# EAGLE schematic Schematic (EAGLE 9.6.2)
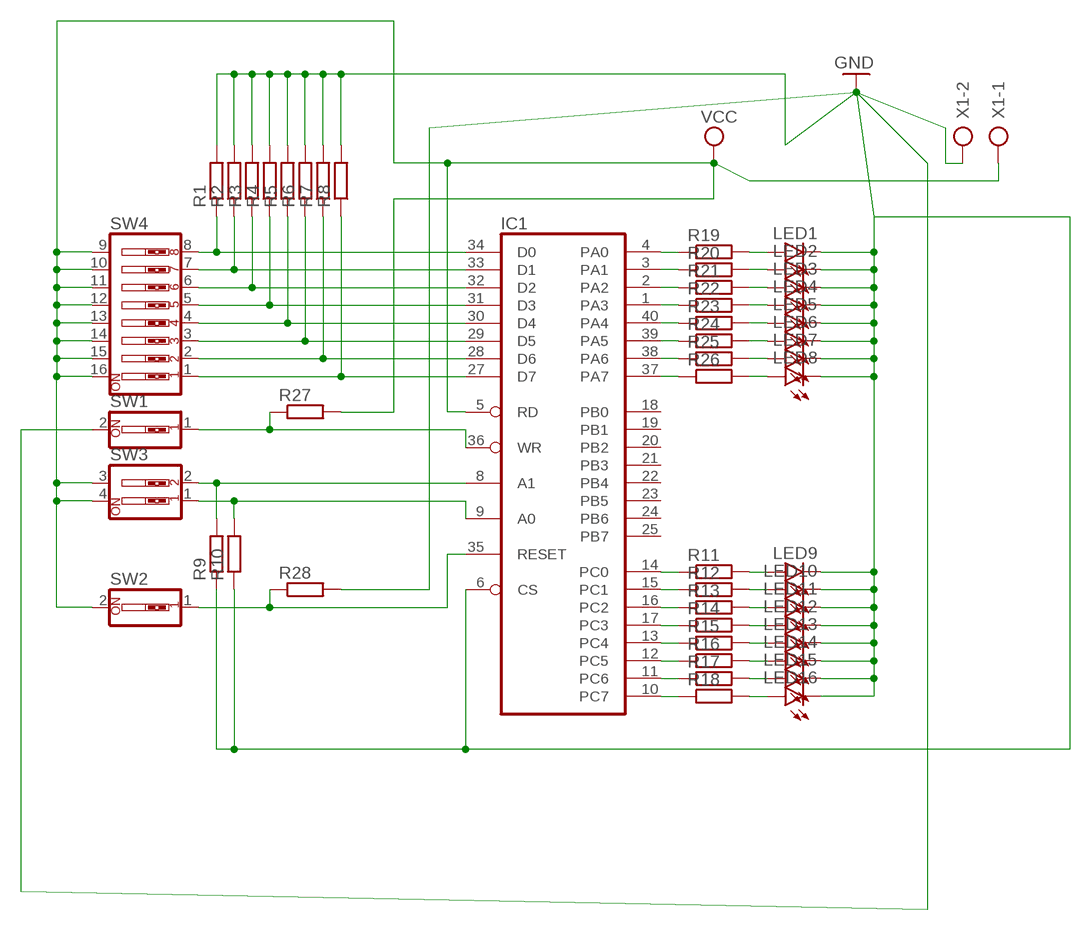
[diagram p0: schematic, sheet 1]

## Parts
IC1  8255A  [DIL40]
LED1  LED5MM  [LED5MM]
LED2  LED5MM  [LED5MM]
LED3  LED5MM  [LED5MM]
LED4  LED5MM  [LED5MM]
LED5  LED5MM  [LED5MM]
LED6  LED5MM  [LED5MM]
LED7  LED5MM  [LED5MM]
LED8  LED5MM  [LED5MM]
LED9  LED5MM  [LED5MM]
LED10  LED5MM  [LED5MM]
LED11  LED5MM  [LED5MM]
LED12  LED5MM  [LED5MM]
LED13  LED5MM  [LED5MM]
LED14  LED5MM  [LED5MM]
LED15  LED5MM  [LED5MM]
LED16  LED5MM  [LED5MM]
R1  R-EU_0207/10  [0207/10]
R2  R-EU_0207/10  [0207/10]
R3  R-EU_0207/10  [0207/10]
R4  R-EU_0207/10  [0207/10]
R5  R-EU_0207/10  [0207/10]
R6  R-EU_0207/10  [0207/10]
R7  R-EU_0207/10  [0207/10]
R8  R-EU_0207/10  [0207/10]
R9  R-EU_0207/10  [0207/10]
R10  R-EU_0207/10  [0207/10]
R11  R-EU_0207/10  [0207/10]
R12  R-EU_0207/10  [0207/10]
R13  R-EU_0207/10  [0207/10]
R14  R-EU_0207/10  [0207/10]
R15  R-EU_0207/10  [0207/10]
R16  R-EU_0207/10  [0207/10]
R17  R-EU_0207/10  [0207/10]
R18  R-EU_0207/10  [0207/10]
R19  R-EU_0207/10  [0207/10]
R20  R-EU_0207/10  [0207/10]
R21  R-EU_0207/10  [0207/10]
R22  R-EU_0207/10  [0207/10]
R23  R-EU_0207/10  [0207/10]
R24  R-EU_0207/10  [0207/10]
R25  R-EU_0207/10  [0207/10]
R26  R-EU_0207/10  [0207/10]
R27  R-EU_0207/10  [0207/10]
R28  R-EU_0207/10  [0207/10]
SW1  SW_DIP-1  [EDG-01]
SW2  SW_DIP-1  [EDG-01]
SW3  SW_DIP-2  [EDG-02]
SW4  SW_DIP-8  [EDG-08]
X1  AK500/2  [AK500/2]

## Nets
GND: IC1.6(CS) LED1.K(C) LED2.K(C) LED3.K(C) LED4.K(C) LED5.K(C) LED6.K(C) LED7.K(C) LED8.K(C) LED9.K(C) LED10.K(C) LED11.K(C) LED12.K(C) LED13.K(C) LED14.K(C) LED15.K(C) LED16.K(C) R1.2 R2.2 R3.2 R4.2 R5.2 R6.2 R7.2 R8.2 R9.1 R10.1 R28.2 SW1.2 X1.2
N$1: IC1.34(D0) R1.1 SW4.8
N$2: IC1.33(D1) R2.1 SW4.7
N$3: IC1.32(D2) R3.1 SW4.6
N$4: IC1.31(D3) R4.1 SW4.5
N$5: IC1.30(D4) R5.1 SW4.4
N$6: IC1.29(D5) R6.1 SW4.3
N$7: IC1.28(D6) R7.1 SW4.2
N$8: IC1.27(D7) R8.1 SW4.1
N$9: IC1.8(A1) R9.2 SW3.2
N$10: IC1.9(A0) R10.2 SW3.1
N$11: IC1.4(PA0) R19.1
N$12: LED1.A R19.2
N$13: LED2.A R20.2
N$14: LED3.A R21.2
N$15: LED4.A R22.2
N$16: LED5.A R23.2
N$17: LED6.A R24.2
N$18: LED7.A R25.2
N$19: LED8.A R26.2
N$20: IC1.37(PA7) R26.1
N$21: IC1.38(PA6) R25.1
N$22: IC1.39(PA5) R24.1
N$23: IC1.40(PA4) R23.1
N$24: IC1.1(PA3) R22.1
N$25: IC1.2(PA2) R21.1
N$26: IC1.3(PA1) R20.1
N$27: IC1.14(PC0) R11.1
N$28: IC1.15(PC1) R12.1
N$29: IC1.16(PC2) R13.1
N$30: IC1.17(PC3) R14.1
N$31: IC1.13(PC4) R15.1
N$32: IC1.12(PC5) R16.1
N$33: IC1.11(PC6) R17.1
N$34: IC1.10(PC7) R18.1
N$35: LED16.A R18.2
N$36: LED15.A R17.2
N$37: LED14.A R16.2
N$38: LED13.A R15.2
N$39: LED12.A R14.2
N$40: LED11.A R13.2
N$41: LED10.A R12.2
N$42: LED9.A R11.2
N$44: IC1.35(RESET) R28.1 SW2.1
N$45: IC1.36(WR) R27.1 SW1.1
VCC: IC1.5(RD) R27.2 SW2.2 SW3.3 SW3.4 SW4.9 SW4.10 SW4.11 SW4.12 SW4.13 SW4.14 SW4.15 SW4.16 X1.1
Unconnected: IC1.18(PB0) IC1.19(PB1) IC1.20(PB2) IC1.21(PB3) IC1.22(PB4) IC1.23(PB5) IC1.24(PB6) IC1.25(PB7)

## Power pins joined to a net without a drawn wire
GND: IC1.7(GND)
VCC: IC1.26(VCC)

## Library data of the parts
IC1 = micro-intel:8255A: MICROCOMPUTER/PERIPHERAL DEVICE; OC_FARNELL: unknown; OC_NEWARK: unknown
LED1-LED16 = led:LED: LED OSRAM: - CHIPLED LG R971, LG N971, LY N971, LG Q971, LY Q971, LO R971, LY R971 LH N974, LH R974 LS Q976, LO Q976, LY Q976 LO Q996 - Hyper CHIPLED LW Q18S LB Q993, LB Q99A, LB R99A - SideLED LS A670, LO A670, LY A670, LG A670, LP A670 LB A673, LV A673, LT A673, LW A673 LH A674 LY A675 LS A676, LA A676, LO A676, LY A676, LW A676 LS A679, LY A679, LG A679 - Hyper Micro SIDELED® LS Y876, LA Y876, LO Y876, LY Y876 LT Y87S - SmartLED LW L88C, LW L88S LB L89C, LB L89S, LG L890 LS L89K, LO L89K, LY L89K LS L896, LA L896, LO L896, LY L896 - TOPLED LS T670, LO T670, LY T670, LG T670, LP T670 LSG T670, LSP T670, LSY T670, LOP T670, LYG T670 LG T671, LOG T671, LSG T671 LB T673, LV T673, LT T673, LW T673 LH T674 LS T676, LA T676, LO T676, LY T676, LB T676, LH T676, LSB T676, LW T676 LB T67C, LV T67C, LT T67C, LS T67K, LO T67K, LY T67K, LW E67C LS E67B, LA E67B, LO E67B, LY E67B, LB E67C, LV E67C, LT E67C LW T67C LS T679, LY T679, LG T679 LS T770, LO T770, LY T770, LG T770, LP T770 LB T773, LV T773, LT T773, LW T773 LH T774 LS E675, LA E675, LY E675, LS T675 LS T776, LA T776, LO T776, LY T776, LB T776 LHGB T686 LT T68C, LB T68C - Hyper Mini TOPLED® LB M676 - Mini TOPLED Santana® LG M470 LS M47K, LO M47K, LY M47K Source: http://www.osram.convergy.de LUXEON: - LUMILED® LXK2-PW12-R00, LXK2-PW12-S00, LXK2-PW14-U00, LXK2-PW14-V00 LXK2-PM12-R00, LXK2-PM12-S00, LXK2-PM14-U00 LXK2-PE12-Q00, LXK2-PE12-R00, LXK2-PE12-S00, LXK2-PE14-T00, LXK2-PE14-U00 LXK2-PB12-K00, LXK2-PB12-L00, LXK2-PB12-M00, LXK2-PB14-N00, LXK2-PB14-P00, LXK2-PB14-Q00 LXK2-PR12-L00, LXK2-PR12-M00, LXK2-PR14-Q00, LXK2-PR14-R00 LXK2-PD12-Q00, LXK2-PD12-R00, LXK2-PD12-S00 LXK2-PH12-R00, LXK2-PH12-S00 LXK2-PL12-P00, LXK2-PL12-Q00, LXK2-PL12-R00 Source: www.luxeon.com KINGBRIGHT: KA-3528ASYC Source: www.kingbright.com
R1-R28 = rcl:R-EU_: RESISTOR, European symbol; SPICEPREFIX: R
SW1 SW2 = special:SW_DIP-1: DIP SWITCH
SW3 = special:SW_DIP-2: DIP SWITCH
SW4 = special:SW_DIP-8: DIP SWITCH
X1 = con-ptr500:AK500/2: CONNECTOR; OC_FARNELL: unknown; OC_NEWARK: unknown